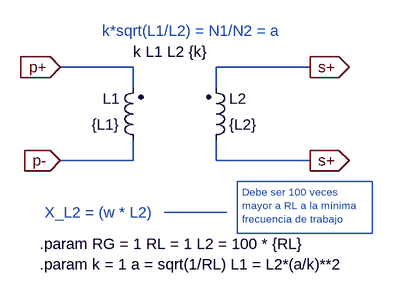
[diagram p0: schematic trafo_no_ideal.asc]
trafo_no_ideal.asc, the LTspice schematic file:
Version 4
SHEET 1 1176 680
WIRE 112 96 0 96
WIRE 384 96 240 96
WIRE 112 128 112 96
WIRE 240 128 240 96
WIRE 112 240 112 208
WIRE 112 240 0 240
WIRE 240 240 240 208
WIRE 384 240 240 240
FLAG 0 96 p+
IOPIN 0 96 In
FLAG 0 240 p-
IOPIN 0 240 In
FLAG 384 96 s+
IOPIN 384 96 Out
FLAG 384 240 s+
IOPIN 384 240 Out
SYMBOL ind2 128 224 R180
WINDOW 0 36 80 Left 2
WINDOW 3 36 40 Left 2
SYMATTR InstName L1
SYMATTR Value {L1}
SYMATTR Type ind
SYMBOL ind2 224 224 M180
WINDOW 0 36 80 Left 2
WINDOW 3 36 40 Left 2
SYMATTR InstName L2
SYMATTR Value {L2}
SYMATTR Type ind
TEXT 112 72 Left 2 !k L1 L2 {k}
TEXT 64 40 Left 2 ;k*sqrt(L1/L2) = N1/N2 = a
TEXT -32 400 Left 2 !.param k = 1 a = sqrt(1/RL) L1 = L2*(a/k)**2
TEXT -32 368 Left 2 !.param RG = 1 RL = 1 L2 = 100 * {RL}
TEXT -24 320 Left 2 ;X_L2 = (w * L2)
TEXT 280 288 Left 1 ;Debe ser 100 veces \nmayor a RL a la mínima \nfrecuencia de trabajo
LINE Normal 256 320 160 320
RECTANGLE Normal 480 352 272 272

The netlist it stands for:
* trafo_no_ideal.asc
L1 p- p+ {L1}
L2 s+ s+ {L2}
k L1 L2 {k}
* k*sqrt(L1/L2) = N1/N2 = a
.param k = 1 a = sqrt(1/RL) L1 = L2*(a/k)**2
.param RG = 1 RL = 1 L2 = 100 * {RL}
* X_L2 = (w * L2)
* Debe ser 100 veces
* mayor a RL a la mínima
* frecuencia de trabajo
.backanno
.end